# Altium project H750-BSC-DK.PrjPcb
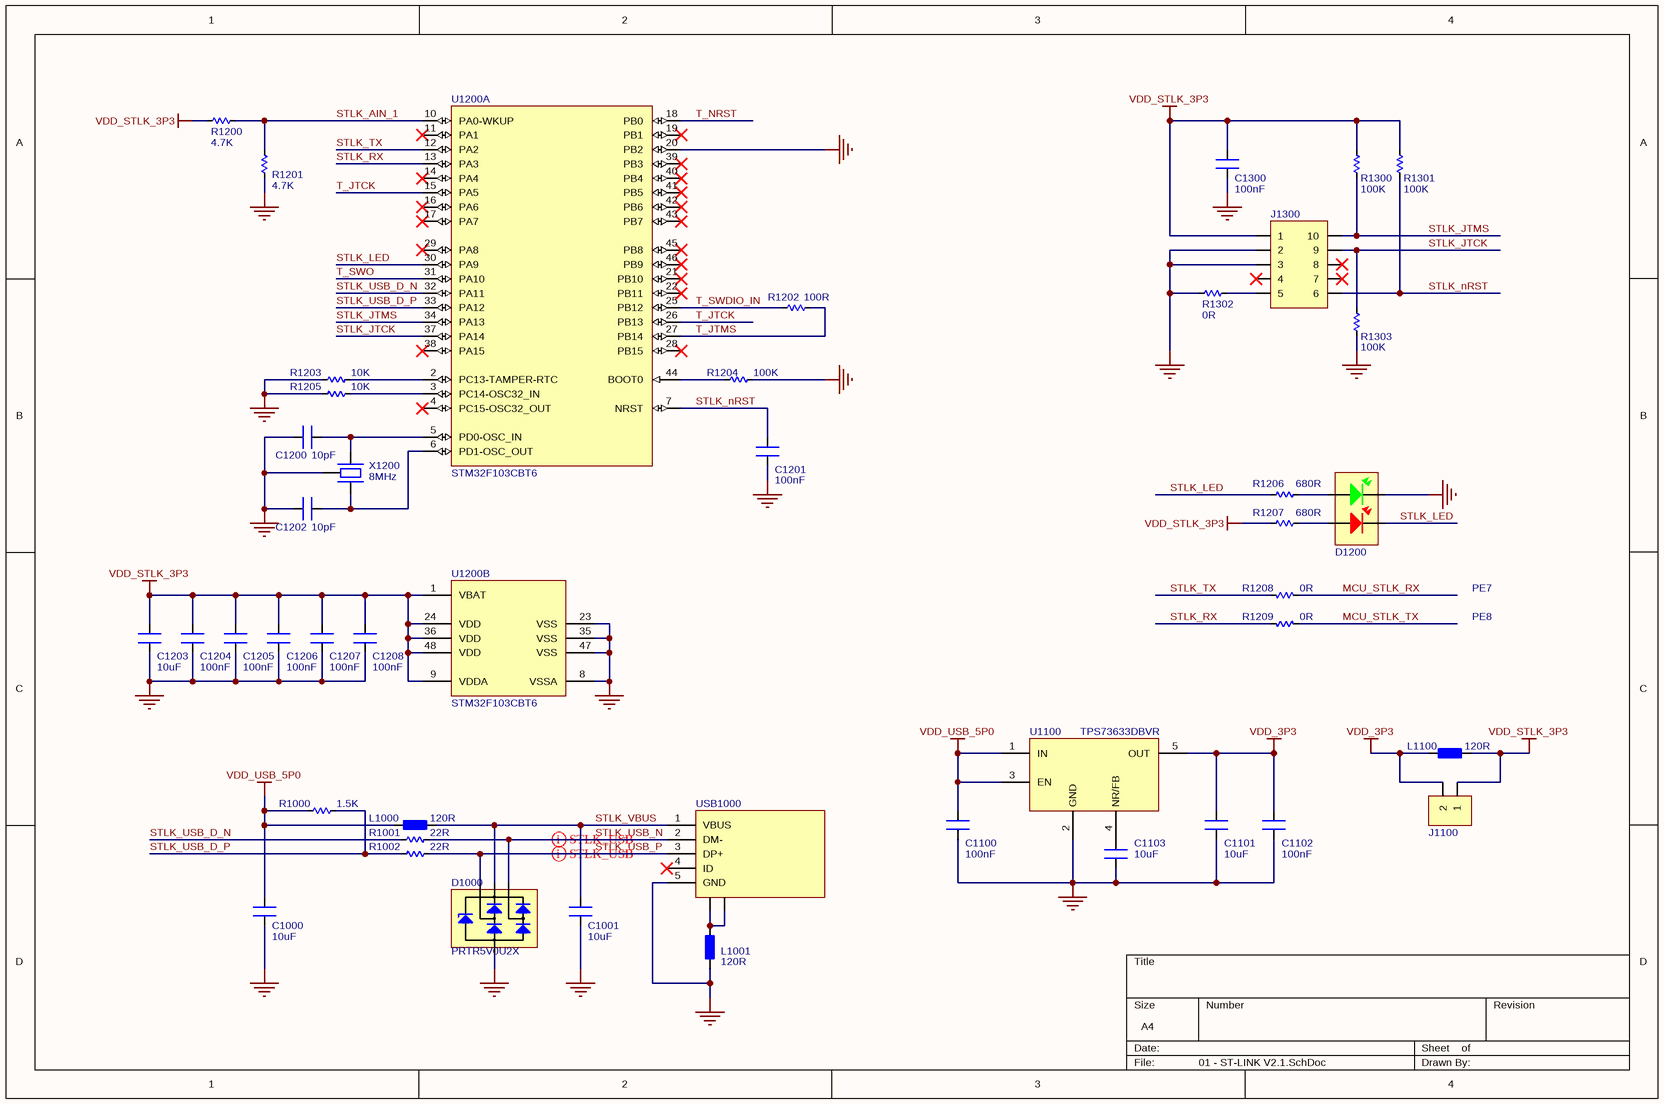
[diagram p0: 01 - ST-LINK V2.1.SchDoc]
7 sheets, 245 parts. Net scope: global (net labels, ports and power ports of the same name join across sheets).
Board file: H750-BSC-DK.PcbDoc
Sheets:
  00 - BLOCK DIAGRAM.SchDoc
  01 - ST-LINK V2.1.SchDoc
  02 - MCU.SchDoc
  03 - ETHERNET.SchDoc
  04 - AUDIO.SchDoc
  05 - QSPI & SD-CARD.SchDoc
  06 - USB.SchDoc

## Sheet 00 - BLOCK DIAGRAM.SchDoc
size A

## Sheet 01 - ST-LINK V2.1.SchDoc
size A4

### Parts
C1000  value 10uF  [CN-SMD-0603]  (hidden comment: Capacitor)
C1001  value 10uF  [CN-SMD-0603]  (hidden comment: Capacitor)
C1100  value 100nF  [CN-SMD-0603]  (hidden comment: Capacitor)
C1101  value 10uF  [CN-SMD-0603]  (hidden comment: Capacitor)
C1102  value 100nF  [CN-SMD-0603]  (hidden comment: Capacitor)
C1103  value 10uF  [CN-SMD-0603]  (hidden comment: Capacitor)
C1200  value 10pF  [CN-SMD-0402]  (hidden comment: Capacitor)
C1201  value 100nF  [CN-SMD-0402]  (hidden comment: Capacitor)
C1202  value 10pF  [CN-SMD-0402]  (hidden comment: Capacitor)
C1203  value 10uF  [CN-SMD-0603]  (hidden comment: Capacitor)
C1204  value 100nF  [CN-SMD-0402]  (hidden comment: Capacitor)
C1205  value 100nF  [CN-SMD-0402]  (hidden comment: Capacitor)
C1206  value 100nF  [CN-SMD-0402]  (hidden comment: Capacitor)
C1207  value 100nF  [CN-SMD-0402]  (hidden comment: Capacitor)
C1208  value 100nF  [CN-SMD-0402]  (hidden comment: Capacitor)
C1300  value 100nF  [CN-SMD-0402]  (hidden comment: Capacitor)
D1000  PRTR5V0U2X  [SOT-143]
D1200  LED  [LED-SMD-1615M-RG]  (value not drawn)
J1100  JP2  [JP2-D1T]  (value not drawn)
J1300  Terminal strip  [JP1.27-10P]  (value not drawn)
L1000  value 120R  [L-SMD-0603]  (hidden comment: Ferrite bead)
L1001  value 120R  [L-SMD-0603]  (hidden comment: Ferrite bead)
L1100  value 120R  [L-SMD-0402]  (hidden comment: Ferrite bead)
R1000  value 1.5K  [RES-SMD-0402]  (hidden comment: Resistor)
R1001  value 22R  [RES-SMD-0402]  (hidden comment: Resistor)
R1002  value 22R  [RES-SMD-0402]  (hidden comment: Resistor)
R1200  value 4.7K  [RES-SMD-0402]  (hidden comment: Resistor)
R1201  value 4.7K  [RES-SMD-0402]  (hidden comment: Resistor)
R1202  value 100R  [RES-SMD-0402]  (hidden comment: Resistor)
R1203  value 10K  [RES-SMD-0402]  (hidden comment: Resistor)
R1204  value 100K  [RES-SMD-0402]  (hidden comment: Resistor)
R1205  value 10K  [RES-SMD-0402]  (hidden comment: Resistor)
R1206  value 680R  [RES-SMD-0402]  (hidden comment: Resistor)
R1207  value 680R  [RES-SMD-0402]  (hidden comment: Resistor)
R1208  value 0R  [RES-SMD-0402]  (hidden comment: Resistor)
R1209  value 0R  [RES-SMD-0402]  (hidden comment: Resistor)
R1300  value 100K  [RES-SMD-0402]  (hidden comment: Resistor)
R1301  value 100K  [RES-SMD-0402]  (hidden comment: Resistor)
R1302  value 0R  [RES-SMD-0402]  (hidden comment: Resistor)
R1303  value 100K  [RES-SMD-0402]  (hidden comment: Resistor)
U1100  TPS73633DBVR  [SOT-23-5]
U1200  STM32F103CBT6  [LQFP50P900X900X160-48N]  (parts A,B of 2)
USB1000  USB  [USB_micro-B_F_SMD-2]  (value not drawn)
X1200  Frequency: 8MHz  [XT-SMD-3213M-3P]  (hidden comment: Crystal)

### Nets
GND: C1000.1 C1001.1 C1100.1 C1101.1 C1102.1 C1103.1 C1200.2 C1201.1 C1202.2 C1203.1 C1204.1 C1205.1 C1206.1 C1207.1 C1208.1 C1300.1 D1000.1(GND) D1200.2(GREEN_CN) J1300.2 J1300.3 L1001.1 R1201.2 R1203.2 R1204.1 R1205.2 R1302.2 R1303.2 U1100.2(GND) U1200.8(VSSA) U1200.20(PB2) U1200.23(VSS) U1200.35(VSS) U1200.47(VSS) USB1000.5(GND) X1200.3
VDD_3P3: C1101.2 C1102.2 J1100.2 L1100.2 U1100.5(OUT)
VDD_STLK_3P3: C1203.2 C1204.2 C1205.2 C1206.2 C1207.2 C1208.2 C1300.2 J1100.1 J1300.1 L1100.1 R1200.2 R1207.2 R1300.1 R1301.1 U1200.1(VBAT) U1200.9(VDDA) U1200.24(VDD) U1200.36(VDD) U1200.48(VDD)
VDD_USB_5P0: C1000.2 C1100.2 L1000.2 R1000.2 U1100.1(IN) U1100.3(EN)
MCU_STLK_RX: R1208.1
MCU_STLK_TX: R1209.1
STLK_AIN_1: R1200.1 R1201.1 U1200.10(PA0-WKUP)
STLK_JTCK: J1300.9 R1303.1 U1200.37(PA14)
STLK_JTMS: J1300.10 R1300.2 U1200.34(PA13)
STLK_LED: D1200.1(RED_CN) R1206.2 U1200.30(PA9)
STLK_nRST: C1201.2 J1300.6 R1301.2 U1200.7(NRST)
STLK_RX: R1209.2 U1200.13(PA3)
STLK_TX: R1208.2 U1200.12(PA2)
STLK_USB_D_N: R1001.2 U1200.32(PA11)
STLK_USB_D_P: R1000.1 R1002.2 U1200.33(PA12)
STLK_USB_N: D1000.3 R1001.1 USB1000.2(DM-)
STLK_USB_P: D1000.2 R1002.1 USB1000.3(DP+)
STLK_VBUS: C1001.2 D1000.4(VDD) L1000.1 USB1000.1(VBUS)
T_JTCK: U1200.15(PA5) U1200.26(PB13)
T_JTMS: R1202.1 U1200.27(PB14)
T_NRST: U1200.18(PB0)
T_SWDIO_IN: R1202.2 U1200.25(PB12)
T_SWO: U1200.31(PA10)
NetC1103_2: C1103.2 U1100.4(NR/FB)
NetC1200_1: C1200.1 U1200.5(PD0-OSC_IN) X1200.1
NetC1202_1: C1202.1 U1200.6(PD1-OSC_OUT) X1200.2
NetD1200_3: D1200.3(GREEN_AN) R1206.1
NetD1200_4: D1200.4(RED_AN) R1207.1
NetJ1300_5: J1300.5 R1302.1
NetL1001_2: L1001.2 USB1000.0
NetR1203_1: R1203.1 U1200.2(PC13-TAMPER-RTC)
NetR1204_2: R1204.2 U1200.44(BOOT0)
NetR1205_1: R1205.1 U1200.3(PC14-OSC32_IN)

Not connected (* = marked no-connect by the designer): J1300 4* 7* 8*; U1200 4(PC15-OSC32_OUT)* 11(PA1)* 14(PA4)* 16(PA6)* 17(PA7)* 19(PB1)* 21(PB10)* 22(PB11)* 28(PB15)* 29(PA8)* 38(PA15)* 39(PB3)* 40(PB4)* 41(PB5)* 42(PB6)* 43(PB7)* 45(PB8)* 46(PB9)*; USB1000 4(ID)*

### Layout directives
differential pair; differential pair class STLK_USB: STLK_USB_N, STLK_USB_P

### Notes on the sheet
- PE7
- PE8

### Library data of the parts
C1000 C1001 C1101 C1103 C1203 = Cap: Ceramic Capacitor SMD 0603 10uF ±20% 10V
C1100 C1102 = Cap: Ceramic Capacitor SMD 0603 100nF ±20% 50V
C1200 C1202 = Cap: Ceramic Capacitor SMD 0402 10pF ±20% 50V
C1201 C1204-C1208 C1300 = Cap: Ceramic Capacitor SMD 0402 100nF ±20% 16V
D1000 = PRTR5V0U2X: Ultra low capacitance double rail-to-rail ESD protection diode
D1200 = LED RG: LED bicolor red green SMD-1615
J1100 = JP2: Single 2-pin jumper
J1300 = JP5x2: Terminal strip 5-pin 2-row pitch 0.05" (1.27mm) SMD straight
L1000 L1001 = Ferrite bead: Ferrite bead SMD 0603 120 Ohm @100MHz
L1100 = Ferrite bead: Ferrite bead SMD 0402 120 Ohm @100MHz
R1000 = Res: Resistor SMD 0402 1.5K 1% 0.063W
R1001 R1002 = Res: Resistor SMD 0402 22R 1% 0.063W
R1200 R1201 = Res: Resistor SMD 0402 4.7K 1% 0.063W
R1202 = Res: Resistor SMD 0402 100R 1% 0.063W
R1203 R1205 = Res: Resistor SMD 0402 10K 1% 0.063W
R1204 R1300 R1301 R1303 = Res: Resistor SMD 0402 100K 1% 0.063W
R1206 R1207 = Res: Resistor SMD 0402 680R 1% 0.063W
R1208 R1209 R1302 = Res: Resistor SMD 0402 0R 1% 0.063W
U1100 = TPS73633DBVR: Cap-Free, NMOS, 400-mA Low-Dropout Regulator with Reverse Current Protection
U1200 = STM32F103CBT6: ARM Cortex-M3 32-bit MCU, 128 KB Flash, 20 KB Internal RAM, 37 I/Os, 48-pin LQFP, -40 to 85 degC, Tray; A/D Converter: 2x12-bit (10 Channel); FLASH Size (Prog) (kB): 128; I/Os (High Current): 37; Internal RAM Size (kB): 20; Operating Frequency(F) (Processor speed) (MHz): 72; Supply Voltage(Vcc) min (V): 2; DatasheetVersion: Rev. 16; PackageVersion: Rev. 6, 06/2013; PackageReference: LQFP48; PackageDescription: 48-Pin Low Profile Quad Flat Package, 7 x 7 mm Body, 0.5 mm Pitch; Supplier 1: Digi-Key; Supplier Part Number 1: 497-6288-ND; Supplier 2: Farnell; Supplier Part Number 2: 1606327; Supplier 3: Newark; Supplier Part Number 3: 11N8296; Supplier 4: Newark; Supplier Part Number 4: 57P1214; Supplier 5: Mouser; Supplier Part Number 5: 511-STM32F103CBT6; Core: ARM Cortex-M3; Packing: Tray; Mounting Technology: Surface Mount; PartNumber: STM32F103CBT6; ComponentLink1Description: Manufacturer URL; ComponentLink1URL: http://www.st.com/web/en/home.html; ComponentLink2Description: Datasheet; ComponentLink2URL: http://www.st.com/st-web-ui/static/active/en/resource/technical/document/datasheet/CD00161566.pdf; ComponentLink3Description: Package Specification; ComponentLink3URL: http://www.st.com/st-web-ui/static/active/en/resource/technical/document/datasheet/DM00058181.pdf
USB1000 = USB-5: USB female SMD micro-B type
X1200 = XT3: Crystal Oscillator SMD-3123 8MHz 3-pin

## Sheet 02 - MCU.SchDoc
size A3
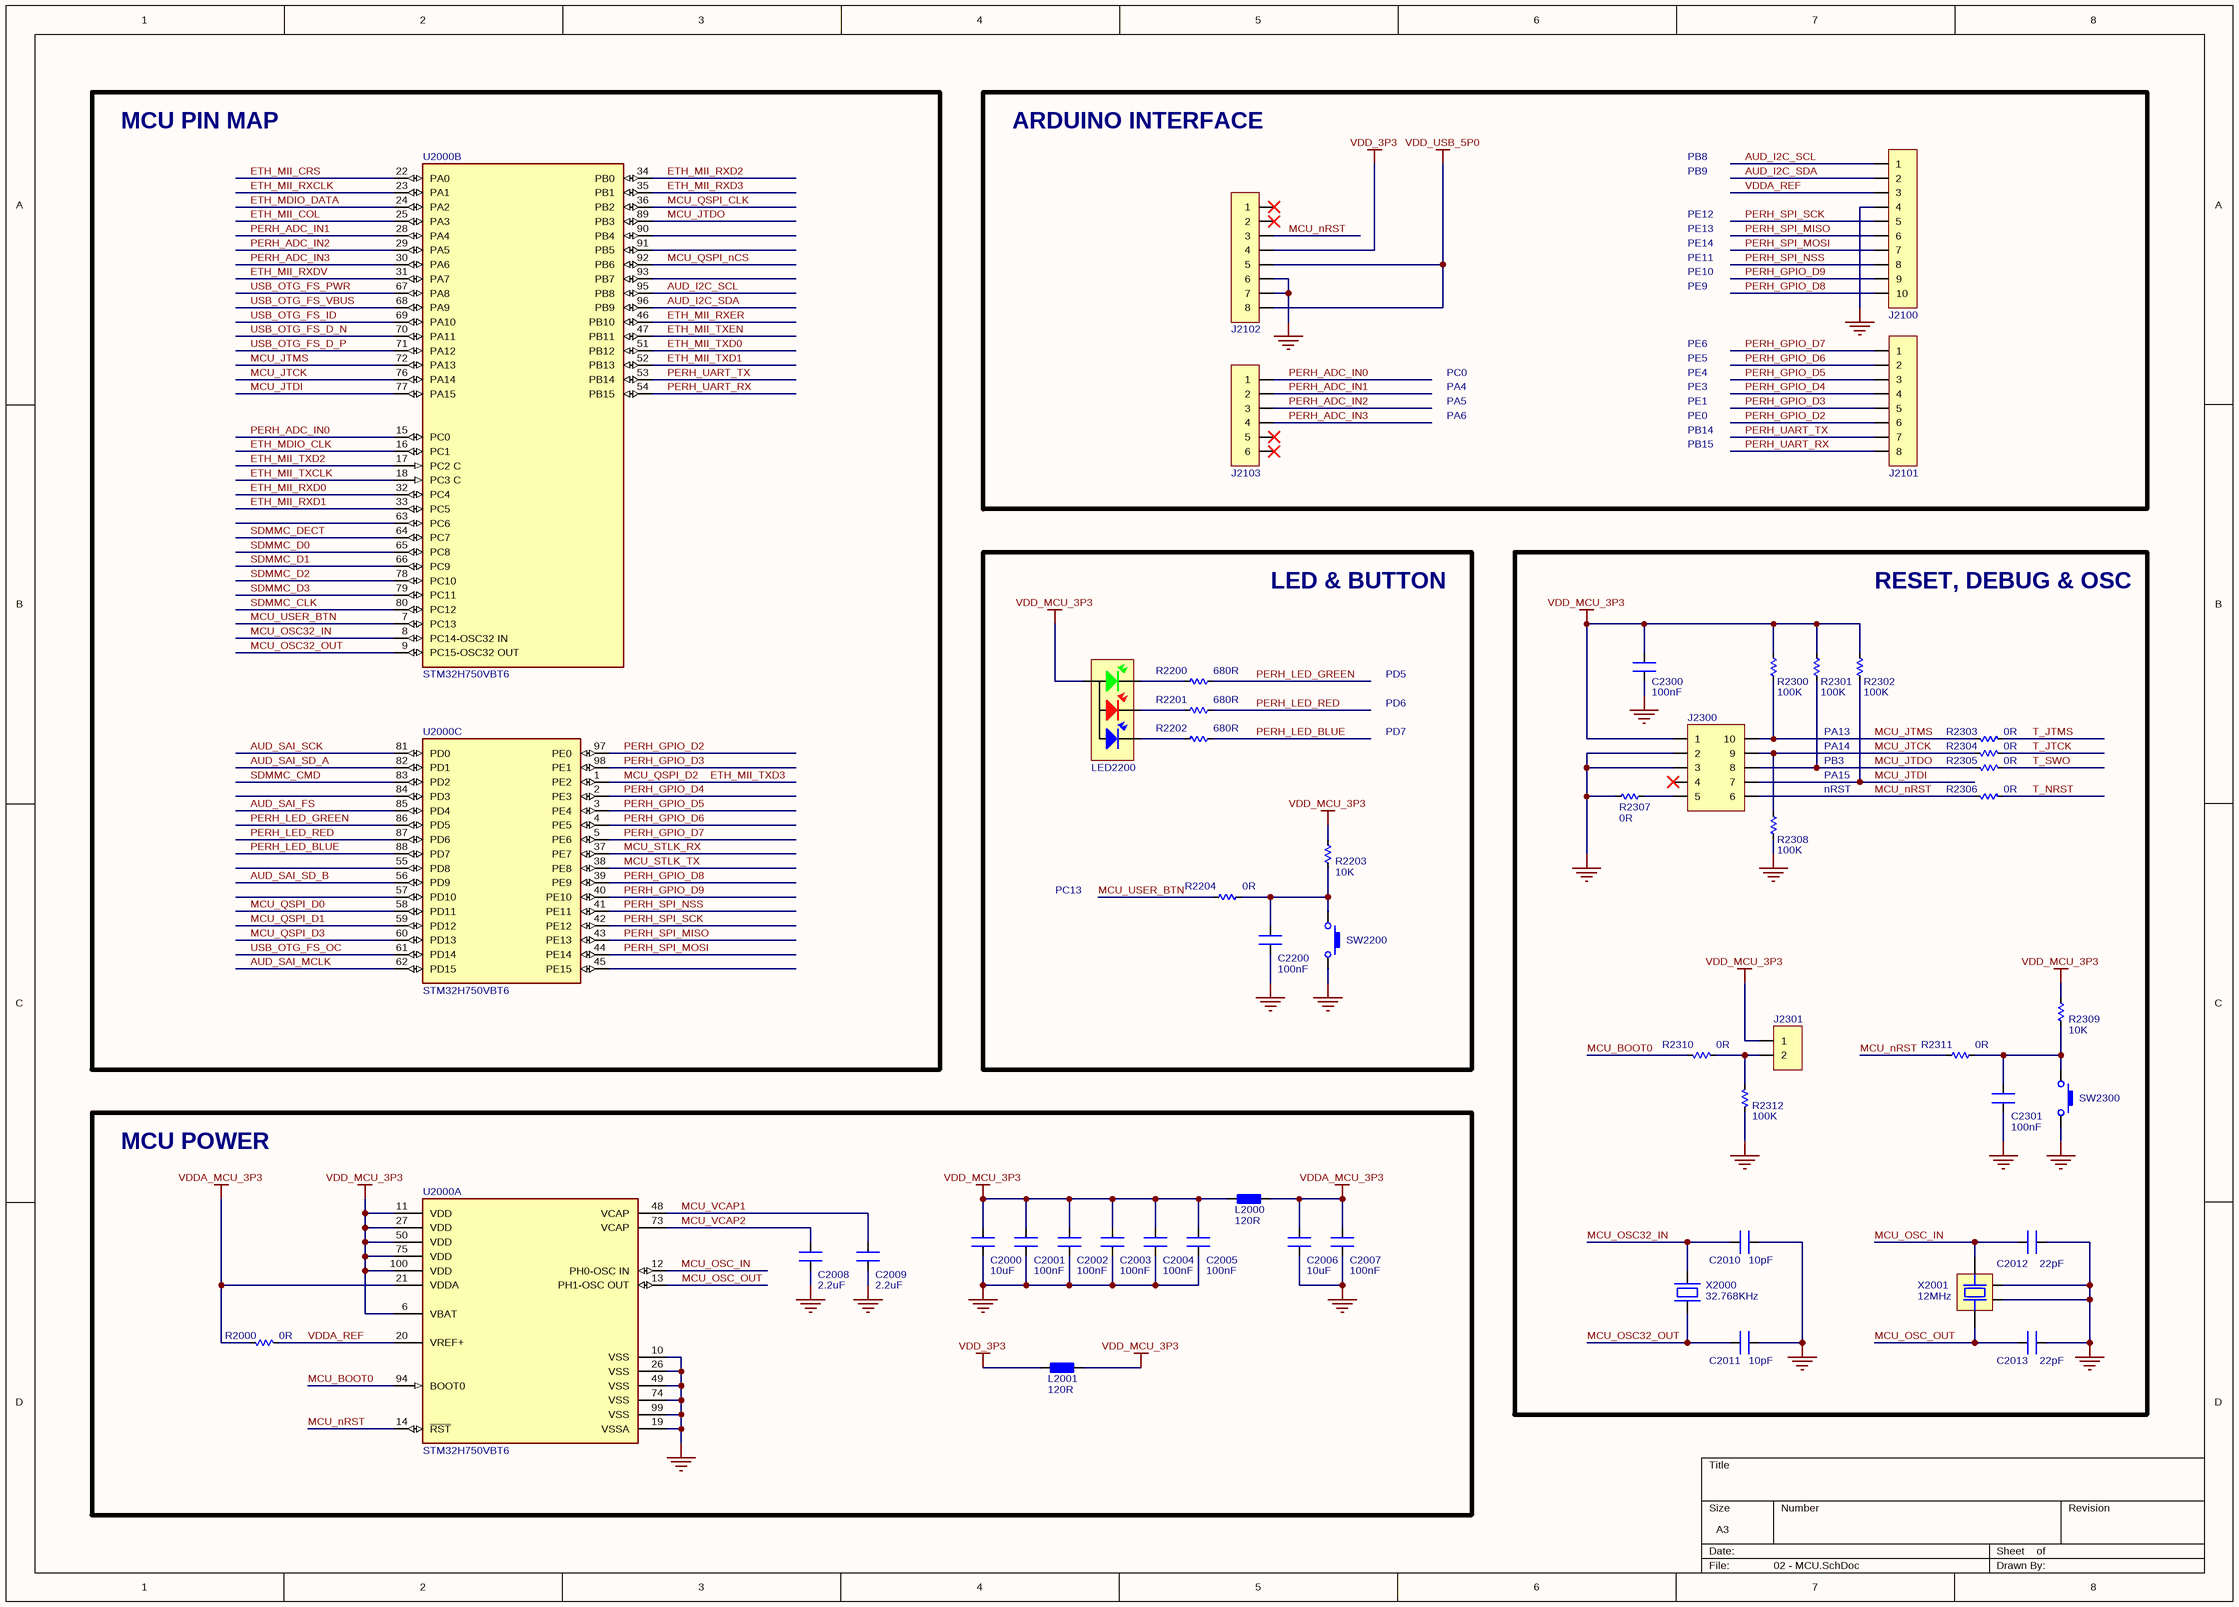
[diagram p1: 02 - MCU.SchDoc]

### Parts
C2000  value 10uF  [CN-SMD-0603]  (hidden comment: Capacitor)
C2001  value 100nF  [CN-SMD-0402]  (hidden comment: Capacitor)
C2002  value 100nF  [CN-SMD-0402]  (hidden comment: Capacitor)
C2003  value 100nF  [CN-SMD-0402]  (hidden comment: Capacitor)
C2004  value 100nF  [CN-SMD-0402]  (hidden comment: Capacitor)
C2005  value 100nF  [CN-SMD-0402]  (hidden comment: Capacitor)
C2006  value 10uF  [CN-SMD-0603]  (hidden comment: Capacitor)
C2007  value 100nF  [CN-SMD-0402]  (hidden comment: Capacitor)
C2008  value 2.2uF  [CN-SMD-0603]  (hidden comment: Capacitor)
C2009  value 2.2uF  [CN-SMD-0603]  (hidden comment: Capacitor)
C2010  value 10pF  [CN-SMD-0402]  (hidden comment: Capacitor)
C2011  value 10pF  [CN-SMD-0402]  (hidden comment: Capacitor)
C2012  value 22pF  [CN-SMD-0402]  (hidden comment: Capacitor)
C2013  value 22pF  [CN-SMD-0402]  (hidden comment: Capacitor)
C2200  value 100nF  [CN-SMD-0402]  (hidden comment: Capacitor)
C2300  value 100nF  [CN-SMD-0402]  (hidden comment: Capacitor)
C2301  value 100nF  [CN-SMD-0402]  (hidden comment: Capacitor)
J2100  Terminal strip  [JP10-C1T]  (value not drawn)
J2101  Terminal strip  [JP8-C1T]  (value not drawn)
J2102  Terminal strip  [JP8-C1T]  (value not drawn)
J2103  Terminal strip  [JP6-C1T]  (value not drawn)
J2300  Terminal strip  [JP1.27-10P]  (value not drawn)
J2301  JP2  [JP2-D1T]  (value not drawn)
L2000  value 120R  [L-SMD-0402]  (hidden comment: Ferrite bead)
L2001  value 120R  [L-SMD-0603]  (hidden comment: Ferrite bead)
LED2200  LED  [LED-SMD-3528-RGB]  (value not drawn)
R2000  value 0R  [RES-SMD-0402]  (hidden comment: Resistor)
R2200  value 680R  [RES-SMD-0402]  (hidden comment: Resistor)
R2201  value 680R  [RES-SMD-0402]  (hidden comment: Resistor)
R2202  value 680R  [RES-SMD-0402]  (hidden comment: Resistor)
R2203  value 10K  [RES-SMD-0402]  (hidden comment: Resistor)
R2204  value 0R  [RES-SMD-0402]  (hidden comment: Resistor)
R2300  value 100K  [RES-SMD-0402]  (hidden comment: Resistor)
R2301  value 100K  [RES-SMD-0402]  (hidden comment: Resistor)
R2302  value 100K  [RES-SMD-0402]  (hidden comment: Resistor)
R2303  value 0R  [RES-SMD-0402]  (hidden comment: Resistor)
R2304  value 0R  [RES-SMD-0402]  (hidden comment: Resistor)
R2305  value 0R  [RES-SMD-0402]  (hidden comment: Resistor)
R2306  value 0R  [RES-SMD-0402]  (hidden comment: Resistor)
R2307  value 0R  [RES-SMD-0402]  (hidden comment: Resistor)
R2308  value 100K  [RES-SMD-0402]  (hidden comment: Resistor)
R2309  value 10K  [RES-SMD-0402]  (hidden comment: Resistor)
R2310  value 0R  [RES-SMD-0402]  (hidden comment: Resistor)
R2311  value 0R  [RES-SMD-0402]  (hidden comment: Resistor)
R2312  value 100K  [RES-SMD-0402]  (hidden comment: Resistor)
SW2200  Switch  [SW2-SMD-3x4x2M]  (value not drawn)
SW2300  Switch  [SW2-SMD-3x4x2M]  (value not drawn)
U2000  STM32H750VBT6  [FP-LQFP100-1L-IPC_A]  (parts A,B,C of 3)
X2000  value 32.768KHz  [XT-SMD-FC-135]  (hidden comment: Crystal)
X2001  value 12MHz  [XT-SMD-3225-4P]  (hidden comment: Crystal)

### Blocks framed on the sheet
MCU PIN MAP: U2000
ARDUINO INTERFACE: J2100-J2103
LED & BUTTON: C2200 LED2200 R2200-R2204 SW2200
RESET, DEBUG & OSC: C2010-C2013 C2300 C2301 J2300 J2301 R2300-R2312 SW2300 X2000 X2001
MCU POWER: C2000-C2009 L2000 L2001 R2000 U2000

### Nets
GND: C2000.1 C2001.1 C2002.1 C2003.1 C2004.1 C2005.1 C2006.1 C2007.1 C2008.1 C2009.1 C2010.1 C2011.1 C2012.2 C2013.2 C2200.1 C2300.1 C2301.1 J2100.4 J2102.6 J2102.7 J2300.2 J2300.3 R2307.2 R2308.2 R2312.2 SW2200.2 SW2300.2 U2000.10(VSS) U2000.19(VSSA) U2000.26(VSS) U2000.49(VSS) U2000.74(VSS) U2000.99(VSS) X2001.2 X2001.4
VDD_3P3: J2102.4 L2001.2
VDD_MCU_3P3: C2000.2 C2001.2 C2002.2 C2003.2 C2004.2 C2005.2 C2300.2 J2300.1 J2301.1 L2000.2 L2001.1 LED2200.2(Common) R2203.1 R2300.1 R2301.1 R2302.1 R2309.1 U2000.6(VBAT) U2000.11(VDD) U2000.27(VDD) U2000.50(VDD) U2000.75(VDD) U2000.100(VDD)
VDD_USB_5P0: J2102.5 J2102.8
VDDA_MCU_3P3: C2006.2 C2007.2 L2000.1 R2000.2 U2000.21(VDDA)
AUD_I2C_SCL: J2100.1 U2000.95(PB8)
AUD_I2C_SDA: J2100.2 U2000.96(PB9)
AUD_SAI_FS: U2000.85(PD4)
AUD_SAI_MCLK: U2000.62(PD15)
AUD_SAI_SCK: U2000.81(PD0)
AUD_SAI_SD_A: U2000.82(PD1)
AUD_SAI_SD_B: U2000.56(PD9)
ETH_MDIO_CLK: U2000.16(PC1)
ETH_MDIO_DATA: U2000.24(PA2)
ETH_MII_COL: U2000.25(PA3)
ETH_MII_CRS: U2000.22(PA0)
ETH_MII_RXCLK: U2000.23(PA1)
ETH_MII_RXD0: U2000.32(PC4)
ETH_MII_RXD1: U2000.33(PC5)
ETH_MII_RXD2: U2000.34(PB0)
ETH_MII_RXD3: U2000.35(PB1)
ETH_MII_RXDV: U2000.31(PA7)
ETH_MII_RXER: U2000.46(PB10)
ETH_MII_TXCLK: U2000.18(PC3_C)
ETH_MII_TXD0: U2000.51(PB12)
ETH_MII_TXD1: U2000.52(PB13)
ETH_MII_TXD2: U2000.17(PC2_C)
ETH_MII_TXD3: U2000.1(PE2)  [also labelled MCU_QSPI_D2]
ETH_MII_TXEN: U2000.47(PB11)
MCU_BOOT0: R2310.2 U2000.94(BOOT0)
MCU_JTCK: J2300.9 R2304.2 R2308.1 U2000.76(PA14)
MCU_JTDI: J2300.7 R2302.2 U2000.77(PA15)
MCU_JTDO: J2300.8 R2301.2 R2305.2 U2000.89(PB3)
MCU_JTMS: J2300.10 R2300.2 R2303.2 U2000.72(PA13)
MCU_nRST: J2102.3 J2300.6 R2306.2 R2311.1 U2000.14(~{RST})
MCU_OSC32_IN: C2010.2 U2000.8(PC14-OSC32_IN) X2000.2
MCU_OSC32_OUT: C2011.2 U2000.9(PC15-OSC32_OUT) X2000.1
MCU_OSC_IN: C2012.1 U2000.12(PH0-OSC_IN) X2001.3
MCU_OSC_OUT: C2013.1 U2000.13(PH1-OSC_OUT) X2001.1
MCU_QSPI_CLK: U2000.36(PB2)
MCU_QSPI_D0: U2000.58(PD11)
MCU_QSPI_D1: U2000.59(PD12)
MCU_QSPI_D3: U2000.60(PD13)
MCU_QSPI_nCS: U2000.92(PB6)
MCU_STLK_RX: U2000.37(PE7)
MCU_STLK_TX: U2000.38(PE8)
MCU_USER_BTN: R2204.1 U2000.7(PC13)
MCU_VCAP1: C2009.2 U2000.48(VCAP)
MCU_VCAP2: C2008.2 U2000.73(VCAP)
PERH_ADC_IN0: J2103.1 U2000.15(PC0)
PERH_ADC_IN1: J2103.2 U2000.28(PA4)
PERH_ADC_IN2: J2103.3 U2000.29(PA5)
PERH_ADC_IN3: J2103.4 U2000.30(PA6)
PERH_GPIO_D2: J2101.6 U2000.97(PE0)
PERH_GPIO_D3: J2101.5 U2000.98(PE1)
PERH_GPIO_D4: J2101.4 U2000.2(PE3)
PERH_GPIO_D5: J2101.3 U2000.3(PE4)
PERH_GPIO_D6: J2101.2 U2000.4(PE5)
PERH_GPIO_D7: J2101.1 U2000.5(PE6)
PERH_GPIO_D8: J2100.10 U2000.39(PE9)
PERH_GPIO_D9: J2100.9 U2000.40(PE10)
PERH_LED_BLUE: R2202.2 U2000.88(PD7)
PERH_LED_GREEN: R2200.2 U2000.86(PD5)
PERH_LED_RED: R2201.2 U2000.87(PD6)
PERH_SPI_MISO: J2100.6 U2000.43(PE13)
PERH_SPI_MOSI: J2100.7 U2000.44(PE14)
PERH_SPI_NSS: J2100.8 U2000.41(PE11)
PERH_SPI_SCK: J2100.5 U2000.42(PE12)
PERH_UART_RX: J2101.8 U2000.54(PB15)
PERH_UART_TX: J2101.7 U2000.53(PB14)
SDMMC_CLK: U2000.80(PC12)
SDMMC_CMD: U2000.83(PD2)
SDMMC_D0: U2000.65(PC8)
SDMMC_D1: U2000.66(PC9)
SDMMC_D2: U2000.78(PC10)
SDMMC_D3: U2000.79(PC11)
SDMMC_DECT: U2000.64(PC7)
T_JTCK: R2304.1
T_JTMS: R2303.1
T_NRST: R2306.1
T_SWO: R2305.1
USB_OTG_FS_D_N: U2000.70(PA11)
USB_OTG_FS_D_P: U2000.71(PA12)
USB_OTG_FS_ID: U2000.69(PA10)
USB_OTG_FS_OC: U2000.61(PD14)
USB_OTG_FS_PWR: U2000.67(PA8)
USB_OTG_FS_VBUS: U2000.68(PA9)
VDDA_REF: J2100.3 R2000.1 U2000.20(VREF+)
NetC2200_2: C2200.2 R2203.2 R2204.2 SW2200.1
NetC2301_2: C2301.2 R2309.2 R2311.2 SW2300.1
NetJ2300_5: J2300.5 R2307.1
NetJ2301_2: J2301.2 R2310.1 R2312.1
NetLED2200_1: LED2200.1(Red_Cathode) R2201.1
NetLED2200_3: LED2200.3(Blue_Cathode) R2202.1
NetLED2200_4: LED2200.4(Green_Cathode) R2200.1

Not connected (* = marked no-connect by the designer): J2102 1* 2*; J2103 5* 6*; J2300 4*; U2000 45(PE15) 55(PD8) 57(PD10) 63(PC6) 84(PD3) 90(PB4) 91(PB5) 93(PB7)

### Notes on the sheet
- PB8
- PB9
- PE12
- PE13
- PE14
- PE11
- PE9
- PE10
- PC0
- PA4
- PA5
- PE1
- PE3
- PE4
- PE5
- PE6
- PA6
- PB14
- PB15
- PE0
- PD5
- PD6
- PD7
- PA13
- PA14
- PB3
- PA15
- nRST
- PC13

### Library data of the parts
C2000 C2006 = Cap: Ceramic Capacitor SMD 0603 10uF ±20% 10V
C2001-C2005 C2007 C2200 C2300 C2301 = Cap: as C1201 on sheet 01 - ST-LINK V2.1
C2008 C2009 = Cap: Ceramic Capacitor SMD 0603 2.2uF ±20% 16V
C2010 C2011 = Cap: Ceramic Capacitor SMD 0402 10pF ±20% 50V
C2012 C2013 = Cap: Ceramic Capacitor SMD 0402 22pF ±20% 50V
J2100 = JP10: Terminal strip 10-pin 1-row pitch 0.1" (2.54mm) DIP straight
J2101 J2102 = JP8: Terminal strip 8-pin 1-row pitch 0.1" (2.54mm) DIP straight
J2103 = JP6: Terminal strip 6-pin 1-row pitch 0.1" (2.54mm) DIP straight
J2300 = JP5x2: as J1300 on sheet 01 - ST-LINK V2.1
J2301 = JP2: Single 2-pin jumper
L2000 = Ferrite bead: Ferrite bead SMD 0402 120 Ohm @100MHz
L2001 = Ferrite bead: Ferrite bead SMD 0603 120 Ohm @100MHz
LED2200 = LED RGB CA: LED RGB Common Anode SMD-3528
R2000 R2204 R2303-R2307 R2310 R2311 = Res: Resistor SMD 0402 0R 1% 0.063W
R2200-R2202 = Res: Resistor SMD 0402 680R 1% 0.063W
R2203 R2309 = Res: Resistor SMD 0402 10K 1% 0.063W
R2300-R2302 R2308 R2312 = Res: Resistor SMD 0402 100K 1% 0.063W
SW2200 SW2300 = SW2: Tackle Switch 2-pin SMD 3x4x2mm
U2000 = CMP-12105-000017-1: 32-bit Arm® Cortex®-M7 480MHz MCUs, 128 Kbyte Flash, 1 Mbyte RAM, 46 com. and analog interfaces, crypto; Manufacturer: STMicroelectronics; Number Of Uart Channels: 9; Number Of I/Os: 82; Max Junction Temp: +125°C; Data Bus Width: 32bits; Ram Size: 1MBytes; Min Supply Voltage: 1.62V; Number Of Spi Channels: 6; Number Of Adc Channels: 36; Max Supply Voltage: 3.6V; Standoff Height: 0.05mm; Interface: I2C,SPI,UART,USART,CAN,USB,LIN,IrDA,Ethernet,I2S,Other; Number Of A/D Converters: 3; Number Of I2C Channels: 4; Memory Size: 128KBytes; Number Of Timers/Counters: 20; Number Of Ethernet Channels: 1; Core Architecture: ARM Cortex-M7; Number Of Usb Channels: 2; Number Of Pwm Channels: 42; Ambient Temperature Range High: +85°C; Temperature: -40°C to +125°C; ComponentLink2URL: https://www.st.com/resource/en/datasheet/stm32h750vb.pdf; Device Class L2: Embedded Processors and Controllers; Temperature Range Low: -40°C; Octopart: https://octopart.com/stm32h750vbt6-stmicroelectronics-94048547; Category: IC; Manufacturer Part Number: STM32H750VBT6; Height: 1.6mm; Lead Free: Yes; Device Class L1: Integrated Circuits (ICs); Digikey Description: IC MCU 32BIT 128KB FLASH 100LQFP; RoHS: TRUE; Ambient Temperature Range Low: -40°C; Device Class L3: Microcontrollers; ComponentLink2Description: Datasheet; Frequency: 480MHz; Mouser Description: MCU 32-Bit STM32H750VB ARM Cortex M7 RISC 128KB Flash 1.8V/2.5V/3.3V 100-Pin LQFP Tray; Number Of Cores: 1; Automotive: No; Memory Type: FLASH; Package: LQFP100-1L; Temperature Range High: +125°C
X2000 = XT2: Crystal Oscillator FC-135 32.768KHz 2-pin
X2001 = XT4: Crystal Oscillator SMD-3225 12MHz 4-pin

## Sheet 03 - ETHERNET.SchDoc
size A4
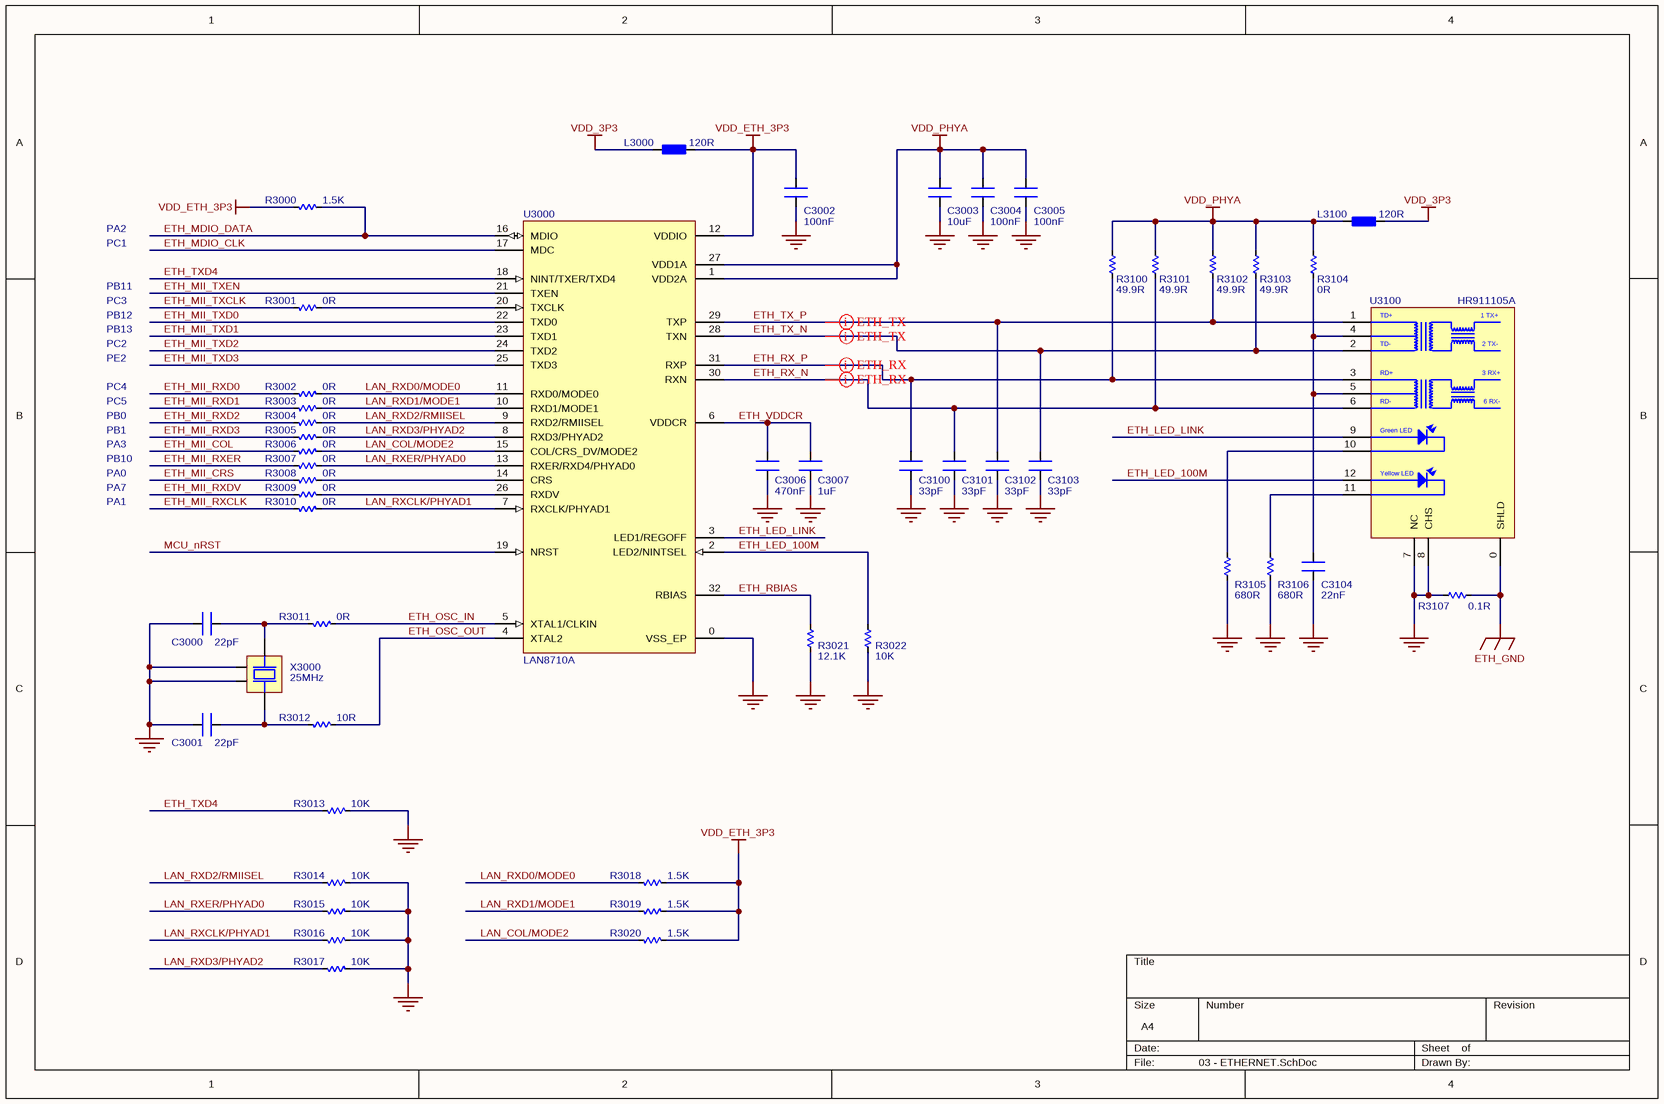
[diagram p2: 03 - ETHERNET.SchDoc]

### Parts
C3000  value 22pF  [CN-SMD-0402]  (hidden comment: Capacitor)
C3001  value 22pF  [CN-SMD-0402]  (hidden comment: Capacitor)
C3002  value 100nF  [CN-SMD-0402]  (hidden comment: Capacitor)
C3003  value 10uF  [CN-SMD-0603]  (hidden comment: Capacitor)
C3004  value 100nF  [CN-SMD-0402]  (hidden comment: Capacitor)
C3005  value 100nF  [CN-SMD-0402]  (hidden comment: Capacitor)
C3006  value 470nF  [CN-SMD-0402]  (hidden comment: Capacitor)
C3007  value 1uF  [CN-SMD-0603]  (hidden comment: Capacitor)
C3100  value 33pF  [CN-SMD-0402]  (hidden comment: Capacitor)
C3101  value 33pF  [CN-SMD-0402]  (hidden comment: Capacitor)
C3102  value 33pF  [CN-SMD-0402]  (hidden comment: Capacitor)
C3103  value 33pF  [CN-SMD-0402]  (hidden comment: Capacitor)
C3104  value 22nF  [CN-SMD-0402]  (hidden comment: Capacitor)
L3000  value 120R  [L-SMD-0603]  (hidden comment: Ferrite bead)
L3100  value 120R  [L-SMD-0603]  (hidden comment: Ferrite bead)
R3000  value 1.5K  [RES-SMD-0402]  (hidden comment: Resistor)
R3001  value 0R  [RES-SMD-0402]  (hidden comment: Resistor)
R3002  value 0R  [RES-SMD-0402]  (hidden comment: Resistor)
R3003  value 0R  [RES-SMD-0402]  (hidden comment: Resistor)
R3004  value 0R  [RES-SMD-0402]  (hidden comment: Resistor)
R3005  value 0R  [RES-SMD-0402]  (hidden comment: Resistor)
R3006  value 0R  [RES-SMD-0402]  (hidden comment: Resistor)
R3007  value 0R  [RES-SMD-0402]  (hidden comment: Resistor)
R3008  value 0R  [RES-SMD-0402]  (hidden comment: Resistor)
R3009  value 0R  [RES-SMD-0402]  (hidden comment: Resistor)
R3010  value 0R  [RES-SMD-0402]  (hidden comment: Resistor)
R3011  value 0R  [RES-SMD-0402]  (hidden comment: Resistor)
R3012  value 10R  [RES-SMD-0402]  (hidden comment: Resistor)
R3013  value 10K  [RES-SMD-0402]  (hidden comment: Resistor)
R3014  value 10K  [RES-SMD-0402]  (hidden comment: Resistor)
R3015  value 10K  [RES-SMD-0402]  (hidden comment: Resistor)
R3016  value 10K  [RES-SMD-0402]  (hidden comment: Resistor)
R3017  value 10K  [RES-SMD-0402]  (hidden comment: Resistor)
R3018  value 1.5K  [RES-SMD-0402]  (hidden comment: Resistor)
R3019  value 1.5K  [RES-SMD-0402]  (hidden comment: Resistor)
R3020  value 1.5K  [RES-SMD-0402]  (hidden comment: Resistor)
R3021  value 12.1K  [RES-SMD-0402]  (hidden comment: Resistor)
R3022  value 10K  [RES-SMD-0402]  (hidden comment: Resistor)
R3100  value 49.9R  [RES-SMD-0402]  (hidden comment: Resistor)
R3101  value 49.9R  [RES-SMD-0402]  (hidden comment: Resistor)
R3102  value 49.9R  [RES-SMD-0402]  (hidden comment: Resistor)
R3103  value 49.9R  [RES-SMD-0402]  (hidden comment: Resistor)
R3104  value 0R  [RES-SMD-0402]  (hidden comment: Resistor)
R3105  value 680R  [RES-SMD-0402]  (hidden comment: Resistor)
R3106  value 680R  [RES-SMD-0402]  (hidden comment: Resistor)
R3107  value 0.1R  [RES-SMD-1206]  (hidden comment: Resistor)
U3000  LAN8710A  [QFN50P500X500X100-33N-D]
U3100  HR911105A  [RJ-45_HR911105A]
X3000  value 25MHz  [XT-SMD-3225-4P]  (hidden comment: Crystal)

### Nets
ETH_GND: R3107.2 U3100.0(SHLD)
GND: C3000.2 C3001.2 C3002.1 C3003.1 C3004.1 C3005.1 C3006.1 C3007.1 C3100.1 C3101.1 C3102.1 C3103.1 C3104.1 R3013.1 R3014.1 R3015.1 R3016.1 R3017.1 R3021.1 R3022.2 R3105.2 R3106.2 R3107.1 U3000.0(VSS_EP) U3100.7(NC) U3100.8(CHS) X3000.2 X3000.4
VDD_3P3: L3000.2 L3100.1
VDD_ETH_3P3: C3002.2 L3000.1 R3000.2 R3018.1 R3019.1 R3020.1 U3000.12(VDDIO)
VDD_PHYA: C3003.2 C3004.2 C3005.2 L3100.2 R3100.1 R3101.1 R3102.1 R3103.1 R3104.1 U3000.1(VDD2A) U3000.27(VDD1A)
ETH_LED_100M: R3022.1 U3000.2(LED2/NINTSEL) U3100.12(Yellow+)
ETH_LED_LINK: U3000.3(LED1/REGOFF) U3100.9(Green+)
ETH_MDIO_CLK: U3000.17(MDC)
ETH_MDIO_DATA: R3000.1 U3000.16(MDIO)
ETH_MII_COL: R3006.2
ETH_MII_CRS: R3008.2
ETH_MII_RXCLK: R3010.2
ETH_MII_RXD0: R3002.2
ETH_MII_RXD1: R3003.2
ETH_MII_RXD2: R3004.2
ETH_MII_RXD3: R3005.2
ETH_MII_RXDV: R3009.2
ETH_MII_RXER: R3007.2
ETH_MII_TXCLK: R3001.2
ETH_MII_TXD0: U3000.22(TXD0)
ETH_MII_TXD1: U3000.23(TXD1)
ETH_MII_TXD2: U3000.24(TXD2)
ETH_MII_TXD3: U3000.25(TXD3)
ETH_MII_TXEN: U3000.21(TXEN)
ETH_OSC_IN: R3011.1 U3000.5(XTAL1/CLKIN)
ETH_OSC_OUT: R3012.1 U3000.4(XTAL2)
ETH_RBIAS: R3021.2 U3000.32(RBIAS)
ETH_RX_N: C3101.2 R3101.2 U3000.30(RXN) U3100.6(RD-)
ETH_RX_P: C3100.2 R3100.2 U3000.31(RXP) U3100.3(RD+)
ETH_TX_N: C3103.2 R3103.2 U3000.28(TXN) U3100.2(TD-)
ETH_TX_P: C3102.2 R3102.2 U3000.29(TXP) U3100.1(TD+)
ETH_TXD4: R3013.2 U3000.18(NINT/TXER/TXD4)
ETH_VDDCR: C3006.2 C3007.2 U3000.6(VDDCR)
LAN_COL/MODE2: R3006.1 R3020.2 U3000.15(COL/CRS_DV/MODE2)
LAN_RXCLK/PHYAD1: R3010.1 R3016.2 U3000.7(RXCLK/PHYAD1)
LAN_RXD0/MODE0: R3002.1 R3018.2 U3000.11(RXD0/MODE0)
LAN_RXD1/MODE1: R3003.1 R3019.2 U3000.10(RXD1/MODE1)
LAN_RXD2/RMIISEL: R3004.1 R3014.2 U3000.9(RXD2/RMIISEL)
LAN_RXD3/PHYAD2: R3005.1 R3017.2 U3000.8(RXD3/PHYAD2)
LAN_RXER/PHYAD0: R3007.1 R3015.2 U3000.13(RXER/RXD4/PHYAD0)
MCU_nRST: U3000.19(NRST)
NetC3000_1: C3000.1 R3011.2 X3000.3
NetC3001_1: C3001.1 R3012.2 X3000.1
NetC3104_2: C3104.2 R3104.2 U3100.4(2,5V) U3100.5(2,5V)
NetR3001_1: R3001.1 U3000.20(TXCLK)
NetR3008_1: R3008.1 U3000.14(CRS)
NetR3009_1: R3009.1 U3000.26(RXDV)
NetR3105_1: R3105.1 U3100.10(Green-)
NetR3106_1: R3106.1 U3100.11(Yellow-)

### Layout directives
differential pair; differential pair class ETH_TX: ETH_TX_N, ETH_TX_P
differential pair; differential pair class ETH_RX: ETH_RX_N, ETH_RX_P

### Notes on the sheet
- PA2
- PC1
- PB11
- PB12
- PB13
- PC3
- PC2
- PC4
- PC5
- PE2
- PA0
- PA3
- PB0
- PB1
- PB10
- PA1
- PA7
- (in symbol HR911105A) 1 TX+; 2 TX-; 3 RX+; 6 RX-; Green LED; Yellow LED

### Library data of the parts
C3000 C3001 = Cap: Ceramic Capacitor SMD 0402 22pF ±20% 50V
C3002 C3004 C3005 = Cap: as C1201 on sheet 01 - ST-LINK V2.1
C3003 = Cap: Ceramic Capacitor SMD 0603 10uF ±20% 10V
C3006 = Cap: Ceramic Capacitor SMD 0402 470nF ±20% 10V
C3007 = Cap: Ceramic Capacitor SMD 0603 1uF ±20% 50V
C3100-C3103 = Cap: Ceramic Capacitor SMD 0402 33pF ±20% 50V
C3104 = Cap: Ceramic Capacitor SMD 0402 22nF ±20% 50V
L3000 L3100 = Ferrite bead: Ferrite bead SMD 0603 120 Ohm @100MHz
R3000 R3018-R3020 = Res: Resistor SMD 0402 1.5K 1% 0.063W
R3001-R3011 R3104 = Res: Resistor SMD 0402 0R 1% 0.063W
R3012 = Res: Resistor SMD 0402 10R 1% 0.063W
R3013-R3017 R3022 = Res: Resistor SMD 0402 10K 1% 0.063W
R3021 = Res: Resistor SMD 0402 12.1K 1% 0.063W
R3100-R3103 = Res: Resistor SMD 0402 49.9R 1% 0.063W
R3105 R3106 = Res: Resistor SMD 0402 680R 1% 0.063W
R3107 = Res: Resistor SMD 1206 0.1R 1% 0.25W
U3000 = LAN8710A: Microchip MII/RMII 10/100 Ethernet Transceiver / with HP Auto-MDIX and flexPWR® Technology; Manufacturer_Part_Number: LAN8710AI-EZK; Datasheet Link: http://docs-emea.rs-online.com/webdocs/11b5/0900766b811b5c4b.pdf; Height: 1mm; Manufacturer_Name: Microchip; Mouser Part Number: 886-LAN8710AI-EZK; Mouser Price/Stock: https://www.mouser.com/Search/Refine.aspx?Keyword=886-LAN8710AI-EZK; RS Part Number: 7748024P; RS Price/Stock: http://uk.rs-online.com/web/p/products/7748024P
U3100 = HR911105A: HanRun Single port RJ45 Connector with Integrated Magnetics and LED for 10/100-BaseTX NIC Applications; Value: HR911105A
X3000 = XT4: Crystal Oscillator SMD-3225 25MHz 4-pin

## Sheet 04 - AUDIO.SchDoc
size A4
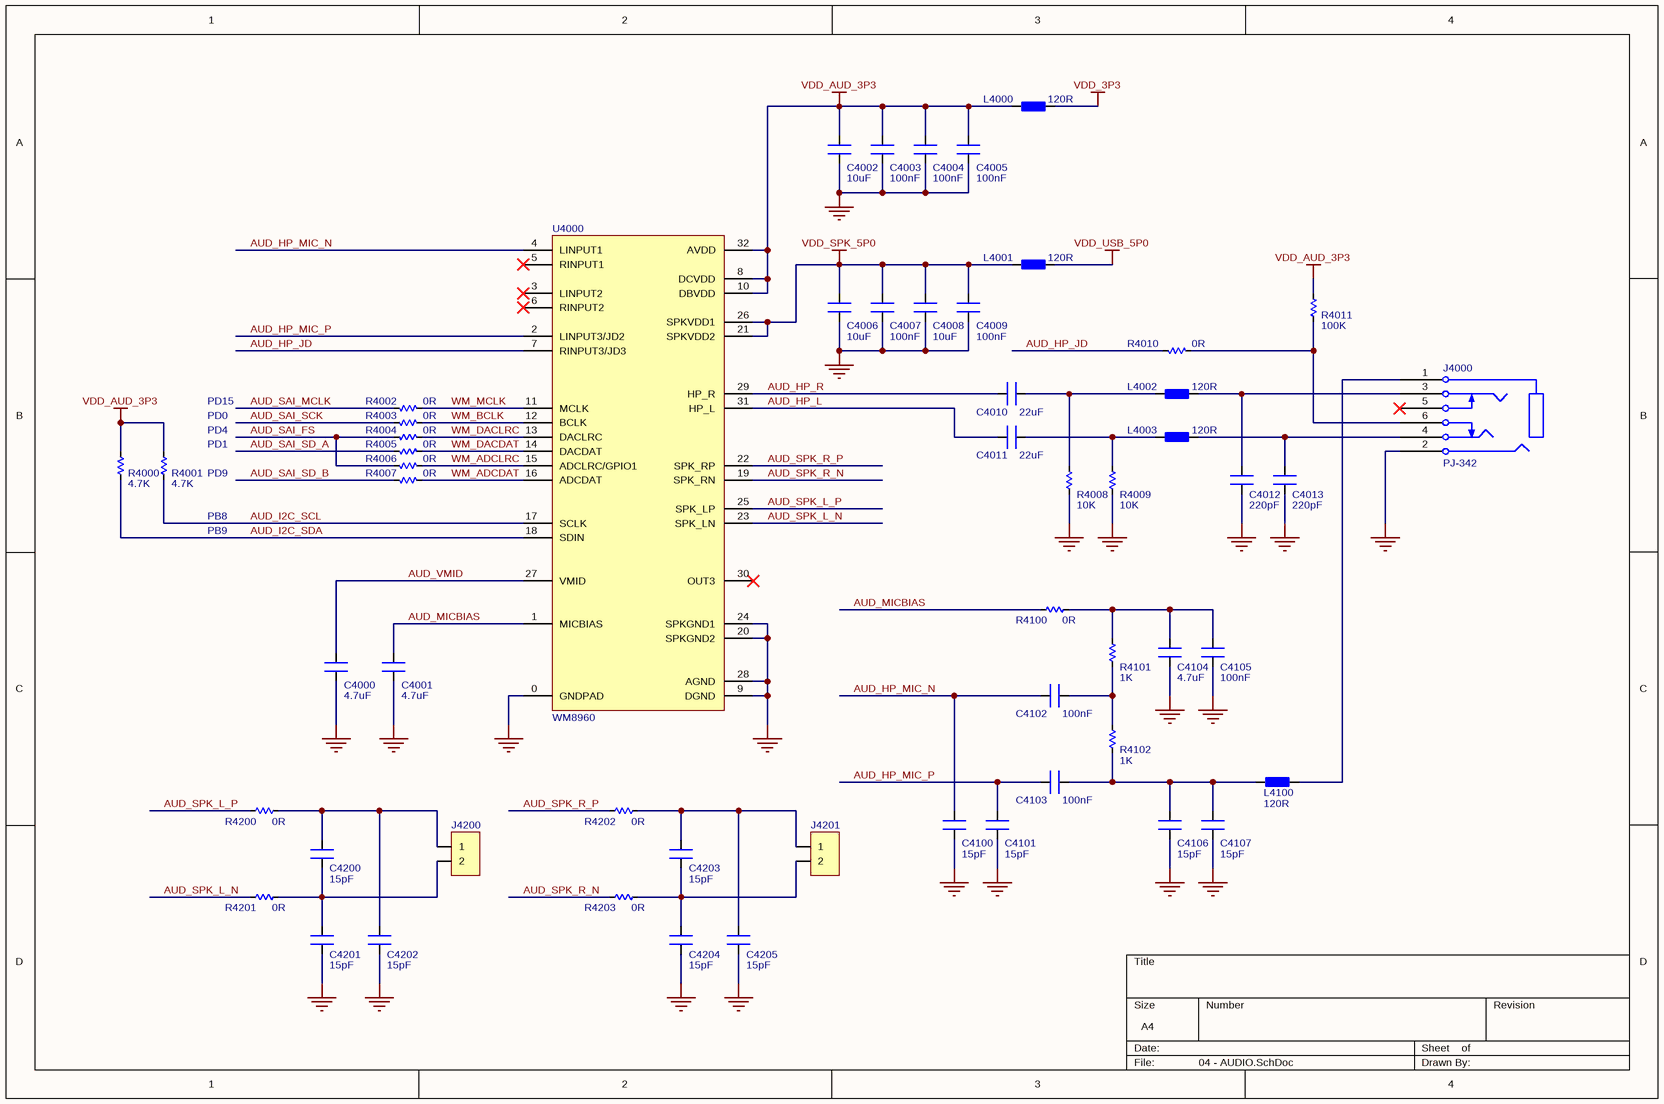
[diagram p3: 04 - AUDIO.SchDoc]

### Parts
C4000  value 4.7uF  [CN-SMD-0402]  (hidden comment: Capacitor)
C4001  value 4.7uF  [CN-SMD-0402]  (hidden comment: Capacitor)
C4002  value 10uF  [CN-SMD-0603]  (hidden comment: Capacitor)
C4003  value 100nF  [CN-SMD-0402]  (hidden comment: Capacitor)
C4004  value 100nF  [CN-SMD-0402]  (hidden comment: Capacitor)
C4005  value 100nF  [CN-SMD-0402]  (hidden comment: Capacitor)
C4006  value 10uF  [CN-SMD-0603]  (hidden comment: Capacitor)
C4007  value 100nF  [CN-SMD-0603]  (hidden comment: Capacitor)
C4008  value 10uF  [CN-SMD-0603]  (hidden comment: Capacitor)
C4009  value 100nF  [CN-SMD-0603]  (hidden comment: Capacitor)
C4010  value 22uF  [CN-SMD-0603]  (hidden comment: Capacitor)
C4011  value 22uF  [CN-SMD-0603]  (hidden comment: Capacitor)
C4012  value 220pF  [CN-SMD-0402]  (hidden comment: Capacitor)
C4013  value 220pF  [CN-SMD-0402]  (hidden comment: Capacitor)
C4100  value 15pF  [CN-SMD-0402]  (hidden comment: Capacitor)
C4101  value 15pF  [CN-SMD-0402]  (hidden comment: Capacitor)
C4102  value 100nF  [CN-SMD-0402]  (hidden comment: Capacitor)
C4103  value 100nF  [CN-SMD-0402]  (hidden comment: Capacitor)
C4104  value 4.7uF  [CN-SMD-0402]  (hidden comment: Capacitor)
C4105  value 100nF  [CN-SMD-0402]  (hidden comment: Capacitor)
C4106  value 15pF  [CN-SMD-0402]  (hidden comment: Capacitor)
C4107  value 15pF  [CN-SMD-0402]  (hidden comment: Capacitor)
C4200  value 15pF  [CN-SMD-0402]  (hidden comment: Capacitor)
C4201  value 15pF  [CN-SMD-0402]  (hidden comment: Capacitor)
C4202  value 15pF  [CN-SMD-0402]  (hidden comment: Capacitor)
C4203  value 15pF  [CN-SMD-0402]  (hidden comment: Capacitor)
C4204  value 15pF  [CN-SMD-0402]  (hidden comment: Capacitor)
C4205  value 15pF  [CN-SMD-0402]  (hidden comment: Capacitor)
J4000  PJ-342  [AUDIO_PJ-342]
J4200  JP2  [JP2-D1T]  (value not drawn)
J4201  JP2  [JP2-D1T]  (value not drawn)
L4000  value 120R  [L-SMD-0402]  (hidden comment: Ferrite bead)
L4001  value 120R  [L-SMD-0603]  (hidden comment: Ferrite bead)
L4002  value 120R  [L-SMD-0402]  (hidden comment: Ferrite bead)
L4003  value 120R  [L-SMD-0402]  (hidden comment: Ferrite bead)
L4100  value 120R  [L-SMD-0402]  (hidden comment: Ferrite bead)
R4000  value 4.7K  [RES-SMD-0402]  (hidden comment: Resistor)
R4001  value 4.7K  [RES-SMD-0402]  (hidden comment: Resistor)
R4002  value 0R  [RES-SMD-0402]  (hidden comment: Resistor)
R4003  value 0R  [RES-SMD-0402]  (hidden comment: Resistor)
R4004  value 0R  [RES-SMD-0402]  (hidden comment: Resistor)
R4005  value 0R  [RES-SMD-0402]  (hidden comment: Resistor)
R4006  value 0R  [RES-SMD-0402]  (hidden comment: Resistor)
R4007  value 0R  [RES-SMD-0402]  (hidden comment: Resistor)
R4008  value 10K  [RES-SMD-0402]  (hidden comment: Resistor)
R4009  value 10K  [RES-SMD-0402]  (hidden comment: Resistor)
R4010  value 0R  [RES-SMD-0402]  (hidden comment: Resistor)
R4011  value 100K  [RES-SMD-0402]  (hidden comment: Resistor)
R4100  value 0R  [RES-SMD-0402]  (hidden comment: Resistor)
R4101  value 1K  [RES-SMD-0402]  (hidden comment: Resistor)
R4102  value 1K  [RES-SMD-0402]  (hidden comment: Resistor)
R4200  value 0R  [RES-SMD-0402]  (hidden comment: Resistor)
R4201  value 0R  [RES-SMD-0402]  (hidden comment: Resistor)
R4202  value 0R  [RES-SMD-0402]  (hidden comment: Resistor)
R4203  value 0R  [RES-SMD-0402]  (hidden comment: Resistor)
U4000  WM8960  [QFN50P500X500X100-33N-D]

### Nets
GND: C4000.1 C4001.1 C4002.1 C4003.1 C4004.1 C4005.1 C4006.1 C4007.1 C4008.1 C4009.1 C4012.1 C4013.1 C4100.1 C4101.1 C4104.1 C4105.1 C4106.1 C4107.1 C4201.1 C4202.1 C4204.1 C4205.1 J4000.2(GND) R4008.2 R4009.2 U4000.0(GNDPAD) U4000.9(DGND) U4000.20(SPKGND2) U4000.24(SPKGND1) U4000.28(AGND)
VDD_3P3: L4000.1
VDD_AUD_3P3: C4002.2 C4003.2 C4004.2 C4005.2 L4000.2 R4000.1 R4001.1 R4011.1 U4000.8(DCVDD) U4000.10(DBVDD) U4000.32(AVDD)
VDD_SPK_5P0: C4006.2 C4007.2 C4008.2 C4009.2 L4001.2 U4000.21(SPKVDD2) U4000.26(SPKVDD1)
VDD_USB_5P0: L4001.1
AUD_HP_JD: R4010.2 U4000.7(RINPUT3/JD3)
AUD_HP_L: C4011.2 U4000.31(HP_L)
AUD_HP_MIC_N: C4100.2 C4102.2 U4000.4(LINPUT1)
AUD_HP_MIC_P: C4101.2 C4103.2 U4000.2(LINPUT3/JD2)
AUD_HP_R: C4010.2 U4000.29(HP_R)
AUD_I2C_SCL: R4001.2 U4000.17(SCLK)
AUD_I2C_SDA: R4000.2 U4000.18(SDIN)
AUD_MICBIAS: C4001.2 R4100.1 U4000.1(MICBIAS)
AUD_SAI_FS: R4004.2 R4006.2
AUD_SAI_MCLK: R4002.2
AUD_SAI_SCK: R4003.2
AUD_SAI_SD_A: R4005.2
AUD_SAI_SD_B: R4007.2
AUD_SPK_L_N: R4201.1 U4000.23(SPK_LN)
AUD_SPK_L_P: R4200.1 U4000.25(SPK_LP)
AUD_SPK_R_N: R4203.1 U4000.19(SPK_RN)
AUD_SPK_R_P: R4202.1 U4000.22(SPK_RP)
AUD_VMID: C4000.2 U4000.27(VMID)
WM_ADCDAT: R4007.1 U4000.16(ADCDAT)
WM_ADCLRC: R4006.1 U4000.15(ADCLRC/GPIO1)
WM_BCLK: R4003.1 U4000.12(BCLK)
WM_DACDAT: R4005.1 U4000.14(DACDAT)
WM_DACLRC: R4004.1 U4000.13(DACLRC)
WM_MCLK: R4002.1 U4000.11(MCLK)
NetC4010_1: C4010.1 L4002.2 R4008.1
NetC4011_1: C4011.1 L4003.2 R4009.1
NetC4012_2: C4012.2 J4000.3(RIGHT) L4002.1
NetC4013_2: C4013.2 J4000.4(LEFT) L4003.1
NetC4102_1: C4102.1 R4101.2 R4102.1
NetC4103_1: C4103.1 C4106.2 C4107.2 L4100.2 R4102.2
NetC4104_2: C4104.2 C4105.2 R4100.2 R4101.1
NetC4200_1: C4200.1 C4201.2 J4200.2 R4201.2
NetC4200_2: C4200.2 C4202.2 J4200.1 R4200.2
NetC4203_1: C4203.1 C4204.2 J4201.2 R4203.2
NetC4203_2: C4203.2 C4205.2 J4201.1 R4202.2
NetJ4000_1: J4000.1(MIC) L4100.1
NetJ4000_6: J4000.6 R4010.1 R4011.2

Not connected (* = marked no-connect by the designer): J4000 5*; U4000 3(LINPUT2)* 5(RINPUT1)* 6(RINPUT2)* 30(OUT3)*

### Notes on the sheet
- PD15
- (near R4001) PD1
- (near R4001) PD4
- (near R4001) PD0
- (near R4001) PD9
- (near R4001) PB8
- PB9

### Library data of the parts
C4000 C4001 C4104 = Cap: Ceramic Capacitor SMD 0402 4.7uF ±20% 10V
C4002 C4006 C4008 = Cap: Ceramic Capacitor SMD 0603 10uF ±20% 10V
C4003-C4005 C4102 C4103 C4105 = Cap: as C1201 on sheet 01 - ST-LINK V2.1
C4007 C4009 = Cap: as C1100 on sheet 01 - ST-LINK V2.1
C4010 C4011 = Cap: Ceramic Capacitor SMD 0603 22uF ±20% 6.3V
C4012 C4013 = Cap: Ceramic Capacitor SMD 0402 220pF ±20% 50V
C4100 C4101 C4106 C4107 C4200-C4205 = Cap: Ceramic Capacitor SMD 0402 15pF ±20% 50V
J4000 = PJ-342: Audio connector PJ-342 3.5mm 4-pole; Connector type: AUDIO BLACK HEADER; Category: Connector; Status: Production
J4200 J4201 = JP2: Single 2-pin jumper
L4000 L4002 L4003 L4100 = Ferrite bead: Ferrite bead SMD 0402 120 Ohm @100MHz
L4001 = Ferrite bead: Ferrite bead SMD 0603 120 Ohm @100MHz
R4000 R4001 = Res: Resistor SMD 0402 4.7K 1% 0.063W
R4002-R4007 R4010 R4100 R4200-R4203 = Res: Resistor SMD 0402 0R 1% 0.063W
R4008 R4009 = Res: Resistor SMD 0402 10K 1% 0.063W
R4011 = Res: Resistor SMD 0402 100K 1% 0.063W
R4101 R4102 = Res: Resistor SMD 0402 1K 1% 0.063W
U4000 = WM8960: Cirrus Logic Stereo CODEC with 1W Stereo Class-D Speaker Drivers and Headphone Drivers for Portable Audio Applications

## Sheet 05 - QSPI & SD-CARD.SchDoc
size A4
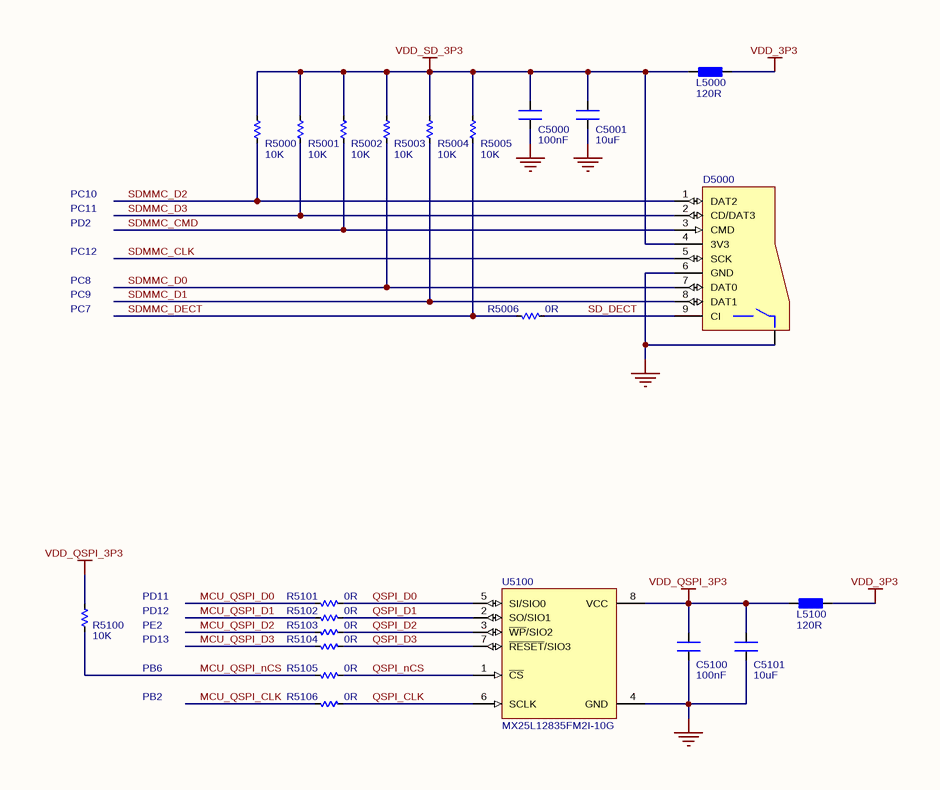
[diagram p4: 05 - QSPI & SD-CARD.SchDoc]

### Parts
C5000  value 100nF  [CN-SMD-0402]  (hidden comment: Capacitor)
C5001  value 10uF  [CN-SMD-0603]  (hidden comment: Capacitor)
C5100  value 100nF  [CN-SMD-0402]  (hidden comment: Capacitor)
C5101  value 10uF  [CN-SMD-0603]  (hidden comment: Capacitor)
D5000  microSD card socket  [MICROSD1]  (value not drawn)
L5000  value 120R  [L-SMD-0402]  (hidden comment: Ferrite bead)
L5100  value 120R  [L-SMD-0402]  (hidden comment: Ferrite bead)
R5000  value 10K  [RES-SMD-0402]  (hidden comment: Resistor)
R5001  value 10K  [RES-SMD-0402]  (hidden comment: Resistor)
R5002  value 10K  [RES-SMD-0402]  (hidden comment: Resistor)
R5003  value 10K  [RES-SMD-0402]  (hidden comment: Resistor)
R5004  value 10K  [RES-SMD-0402]  (hidden comment: Resistor)
R5005  value 10K  [RES-SMD-0402]  (hidden comment: Resistor)
R5006  value 0R  [RES-SMD-0402]  (hidden comment: Resistor)
R5100  value 10K  [RES-SMD-0402]  (hidden comment: Resistor)
R5101  value 0R  [RES-SMD-0402]  (hidden comment: Resistor)
R5102  value 0R  [RES-SMD-0402]  (hidden comment: Resistor)
R5103  value 0R  [RES-SMD-0402]  (hidden comment: Resistor)
R5104  value 0R  [RES-SMD-0402]  (hidden comment: Resistor)
R5105  value 0R  [RES-SMD-0402]  (hidden comment: Resistor)
R5106  value 0R  [RES-SMD-0402]  (hidden comment: Resistor)
U5100  MX25L12835FM2I-10G  [SOIC127P798X216-8N]

### Nets
GND: C5000.1 C5001.1 C5100.1 C5101.1 D5000.0(NC) D5000.6(GND) U5100.4(GND)
VDD_3P3: L5000.1 L5100.1
VDD_QSPI_3P3: C5100.2 C5101.2 L5100.2 R5100.1 U5100.8(VCC)
VDD_SD_3P3: C5000.2 C5001.2 D5000.4(3V3) L5000.2 R5000.1 R5001.1 R5002.1 R5003.1 R5004.1 R5005.1
MCU_QSPI_CLK: R5106.2
MCU_QSPI_D0: R5101.2
MCU_QSPI_D1: R5102.2
MCU_QSPI_D2: R5103.2  [project net ETH_MII_TXD3]
MCU_QSPI_D3: R5104.2
MCU_QSPI_nCS: R5100.2 R5105.2
QSPI_CLK: R5106.1 U5100.6(SCLK)
QSPI_D0: R5101.1 U5100.5(SI/SIO0)
QSPI_D1: R5102.1 U5100.2(SO/SIO1)
QSPI_D2: R5103.1 U5100.3(~{WP}/SIO2)
QSPI_D3: R5104.1 U5100.7(~{RESET}/SIO3)
QSPI_nCS: R5105.1 U5100.1(~{CS})
SD_DECT: D5000.9(CI) R5006.1
SDMMC_CLK: D5000.5(SCK)
SDMMC_CMD: D5000.3(CMD) R5002.2
SDMMC_D0: D5000.7(DAT0) R5003.2
SDMMC_D1: D5000.8(DAT1) R5004.2
SDMMC_D2: D5000.1(DAT2) R5000.2
SDMMC_D3: D5000.2(CD/DAT3) R5001.2
SDMMC_DECT: R5005.2 R5006.2

### Notes on the sheet
- PC10
- PC11
- PD2
- PC8
- PC9
- PC12
- PC7
- PD11
- PD12
- PD13
- PE2
- PB2
- PB6

### Library data of the parts
C5000 C5100 = Cap: as C1201 on sheet 01 - ST-LINK V2.1
C5001 C5101 = Cap: Ceramic Capacitor SMD 0603 10uF ±20% 10V
D5000 = microSD card SDIO
L5000 L5100 = Ferrite bead: Ferrite bead SMD 0402 120 Ohm @100MHz
R5000-R5005 R5100 = Res: Resistor SMD 0402 10K 1% 0.063W
R5006 R5101-R5106 = Res: Resistor SMD 0402 0R 1% 0.063W
U5100 = MX25L12835FM2I-10G: Macronix 3V, 128M-BIT [x1/x2/x4] CMOS MXSMIO® (Serial Multi I/O) Flash Memory

## Sheet 06 - USB.SchDoc
size A4
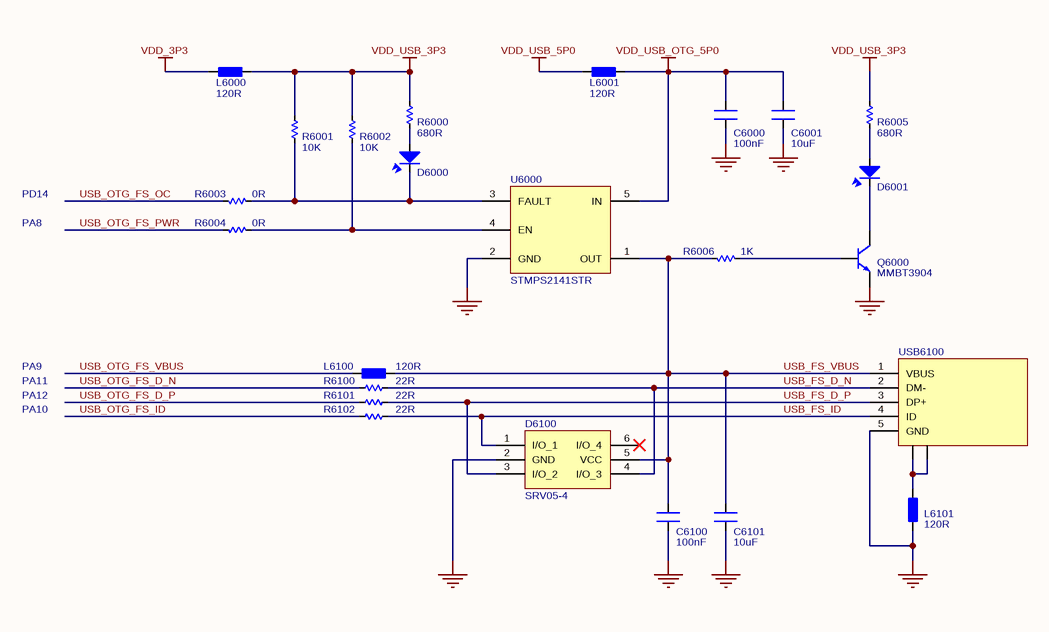
[diagram p5: 06 - USB.SchDoc]

### Parts
C6000  value 100nF  [CN-SMD-0402]  (hidden comment: Capacitor)
C6001  value 10uF  [CN-SMD-0603]  (hidden comment: Capacitor)
C6100  value 100nF  [CN-SMD-0603]  (hidden comment: Capacitor)
C6101  value 10uF  [CN-SMD-0603]  (hidden comment: Capacitor)
D6000  LED  [LED-SMD-0805-RED]  (value not drawn)
D6001  LED  [LED-SMD-0805-GREEN]  (value not drawn)
D6100  SRV05-4  [SOT95P280X145-6N]
L6000  value 120R  [L-SMD-0402]  (hidden comment: Ferrite bead)
L6001  value 120R  [L-SMD-0603]  (hidden comment: Ferrite bead)
L6100  value 120R  [L-SMD-0603]  (hidden comment: Ferrite bead)
L6101  value 120R  [L-SMD-0603]  (hidden comment: Ferrite bead)
Q6000  MMBT3904  [SOT-23-3]
R6000  value 680R  [RES-SMD-0402]  (hidden comment: Resistor)
R6001  value 10K  [RES-SMD-0402]  (hidden comment: Resistor)
R6002  value 10K  [RES-SMD-0402]  (hidden comment: Resistor)
R6003  value 0R  [RES-SMD-0402]  (hidden comment: Resistor)
R6004  value 0R  [RES-SMD-0402]  (hidden comment: Resistor)
R6005  value 680R  [RES-SMD-0402]  (hidden comment: Resistor)
R6006  value 1K  [RES-SMD-0402]  (hidden comment: Resistor)
R6100  value 22R  [RES-SMD-0402]  (hidden comment: Resistor)
R6101  value 22R  [RES-SMD-0402]  (hidden comment: Resistor)
R6102  value 22R  [RES-SMD-0402]  (hidden comment: Resistor)
U6000  STMPS2141STR  [SOT95P280X145-5N]
USB6100  USB  [USB_micro-B_F_SMD-2]  (value not drawn)

### Nets
GND: C6000.1 C6001.1 C6100.1 C6101.1 D6100.2(GND) L6101.1 Q6000.2(Emitter) U6000.2(GND) USB6100.5(GND)
VDD_3P3: L6000.2
VDD_USB_3P3: L6000.1 R6000.1 R6001.1 R6002.1 R6005.1
VDD_USB_5P0: L6001.2
VDD_USB_OTG_5P0: C6000.2 C6001.2 L6001.1 U6000.5(IN)
USB_FS_D_N: D6100.4(I/O_3) R6100.1 USB6100.2(DM-)
USB_FS_D_P: D6100.3(I/O_2) R6101.1 USB6100.3(DP+)
USB_FS_ID: D6100.1(I/O_1) R6102.1 USB6100.4(ID)
USB_FS_VBUS: C6100.2 C6101.2 D6100.5(VCC) L6100.1 R6006.2 U6000.1(OUT) USB6100.1(VBUS)
USB_OTG_FS_D_N: R6100.2
USB_OTG_FS_D_P: R6101.2
USB_OTG_FS_ID: R6102.2
USB_OTG_FS_OC: R6003.2
USB_OTG_FS_PWR: R6004.2
USB_OTG_FS_VBUS: L6100.2
NetD6000_1: D6000.1 R6000.2
NetD6000_2: D6000.2 R6001.2 R6003.1 U6000.3(FAULT)
NetD6001_1: D6001.1 R6005.2
NetD6001_2: D6001.2 Q6000.3(Collector)
NetL6101_2: L6101.2 USB6100.0
NetQ6000_1: Q6000.1(Base) R6006.1
NetR6002_2: R6002.2 R6004.1 U6000.4(EN)

Not connected (* = marked no-connect by the designer): D6100 6(I/O_4)*

### Notes on the sheet
- PA8
- PD14
- PA9
- PA10
- PA11
- PA12

### Library data of the parts
C6000 = Cap: as C1201 on sheet 01 - ST-LINK V2.1
C6001 C6101 = Cap: Ceramic Capacitor SMD 0603 10uF ±20% 10V
C6100 = Cap: as C1100 on sheet 01 - ST-LINK V2.1
D6000 = LED: LED red color SMD-0805
D6001 = LED: LED green color SMD-0805
D6100 = SRV05-4: Low capacitance TVS Diode array
L6000 = Ferrite bead: Ferrite bead SMD 0402 120 Ohm @100MHz
L6001 L6100 L6101 = Ferrite bead: Ferrite bead SMD 0603 120 Ohm @100MHz
Q6000 = MMBT3904: 40V NPN small signal transistor SOT-23-5
R6000 R6005 = Res: Resistor SMD 0402 680R 1% 0.063W
R6001 R6002 = Res: Resistor SMD 0402 10K 1% 0.063W
R6003 R6004 = Res: Resistor SMD 0402 0R 1% 0.063W
R6006 = Res: Resistor SMD 0402 1K 1% 0.063W
R6100-R6102 = Res: Resistor SMD 0402 22R 1% 0.063W
U6000 = STMPS2141STR: Enhanced single channel power switches; Manufacturer_Name: STMicroelectronics; Datasheet Link: http://uk.rs-online.com/web/p/products/8805406; Height: 1.45mm; Manufacturer_Part_Number: STMPS2141STR; Mouser Part Number: 511-STMPS2141STR; Mouser Price/Stock: https://www.mouser.com/Search/Refine.aspx?Keyword=511-STMPS2141STR; RS Part Number: 8805406P; RS Price/Stock: http://uk.rs-online.com/web/p/products/8805406P
USB6100 = USB-5: USB female SMD micro-B type

## Nets that join several sheets
GND: 01 - ST-LINK V2.1 (35 pins), 02 - MCU (35 pins), 03 - ETHERNET (28 pins), 04 - AUDIO (30 pins), 05 - QSPI & SD-CARD (7 pins), 06 - USB (9 pins)
VDD_3P3: 01 - ST-LINK V2.1 (5 pins), 02 - MCU (J2102.4 L2001.2), 03 - ETHERNET (L3000.2 L3100.1), 04 - AUDIO (L4000.1), 05 - QSPI & SD-CARD (L5000.1 L5100.1), 06 - USB (L6000.2)
VDD_USB_5P0: 01 - ST-LINK V2.1 (6 pins), 02 - MCU (J2102.5 J2102.8), 04 - AUDIO (L4001.1), 06 - USB (L6001.2)
AUD_I2C_SCL: 02 - MCU (J2100.1 U2000.95), 04 - AUDIO (R4001.2 U4000.17)
AUD_I2C_SDA: 02 - MCU (J2100.2 U2000.96), 04 - AUDIO (R4000.2 U4000.18)
AUD_SAI_FS: 02 - MCU (U2000.85), 04 - AUDIO (R4004.2 R4006.2)
AUD_SAI_MCLK: 02 - MCU (U2000.62), 04 - AUDIO (R4002.2)
AUD_SAI_SCK: 02 - MCU (U2000.81), 04 - AUDIO (R4003.2)
AUD_SAI_SD_A: 02 - MCU (U2000.82), 04 - AUDIO (R4005.2)
AUD_SAI_SD_B: 02 - MCU (U2000.56), 04 - AUDIO (R4007.2)
ETH_MDIO_CLK: 02 - MCU (U2000.16), 03 - ETHERNET (U3000.17)
ETH_MDIO_DATA: 02 - MCU (U2000.24), 03 - ETHERNET (R3000.1 U3000.16)
ETH_MII_COL: 02 - MCU (U2000.25), 03 - ETHERNET (R3006.2)
ETH_MII_CRS: 02 - MCU (U2000.22), 03 - ETHERNET (R3008.2)
ETH_MII_RXCLK: 02 - MCU (U2000.23), 03 - ETHERNET (R3010.2)
ETH_MII_RXD0: 02 - MCU (U2000.32), 03 - ETHERNET (R3002.2)
ETH_MII_RXD1: 02 - MCU (U2000.33), 03 - ETHERNET (R3003.2)
ETH_MII_RXD2: 02 - MCU (U2000.34), 03 - ETHERNET (R3004.2)
ETH_MII_RXD3: 02 - MCU (U2000.35), 03 - ETHERNET (R3005.2)
ETH_MII_RXDV: 02 - MCU (U2000.31), 03 - ETHERNET (R3009.2)
ETH_MII_RXER: 02 - MCU (U2000.46), 03 - ETHERNET (R3007.2)
ETH_MII_TXCLK: 02 - MCU (U2000.18), 03 - ETHERNET (R3001.2)
ETH_MII_TXD0: 02 - MCU (U2000.51), 03 - ETHERNET (U3000.22)
ETH_MII_TXD1: 02 - MCU (U2000.52), 03 - ETHERNET (U3000.23)
ETH_MII_TXD2: 02 - MCU (U2000.17), 03 - ETHERNET (U3000.24)
ETH_MII_TXD3: 02 - MCU (U2000.1), 03 - ETHERNET (U3000.25), 05 - QSPI & SD-CARD (R5103.2)
ETH_MII_TXEN: 02 - MCU (U2000.47), 03 - ETHERNET (U3000.21)
MCU_nRST: 02 - MCU (5 pins), 03 - ETHERNET (U3000.19)
MCU_QSPI_CLK: 02 - MCU (U2000.36), 05 - QSPI & SD-CARD (R5106.2)
MCU_QSPI_D0: 02 - MCU (U2000.58), 05 - QSPI & SD-CARD (R5101.2)
MCU_QSPI_D1: 02 - MCU (U2000.59), 05 - QSPI & SD-CARD (R5102.2)
MCU_QSPI_D3: 02 - MCU (U2000.60), 05 - QSPI & SD-CARD (R5104.2)
MCU_QSPI_nCS: 02 - MCU (U2000.92), 05 - QSPI & SD-CARD (R5100.2 R5105.2)
MCU_STLK_RX: 01 - ST-LINK V2.1 (R1208.1), 02 - MCU (U2000.37)
MCU_STLK_TX: 01 - ST-LINK V2.1 (R1209.1), 02 - MCU (U2000.38)
SDMMC_CLK: 02 - MCU (U2000.80), 05 - QSPI & SD-CARD (D5000.5)
SDMMC_CMD: 02 - MCU (U2000.83), 05 - QSPI & SD-CARD (D5000.3 R5002.2)
SDMMC_D0: 02 - MCU (U2000.65), 05 - QSPI & SD-CARD (D5000.7 R5003.2)
SDMMC_D1: 02 - MCU (U2000.66), 05 - QSPI & SD-CARD (D5000.8 R5004.2)
SDMMC_D2: 02 - MCU (U2000.78), 05 - QSPI & SD-CARD (D5000.1 R5000.2)
SDMMC_D3: 02 - MCU (U2000.79), 05 - QSPI & SD-CARD (D5000.2 R5001.2)
SDMMC_DECT: 02 - MCU (U2000.64), 05 - QSPI & SD-CARD (R5005.2 R5006.2)
T_JTCK: 01 - ST-LINK V2.1 (U1200.15 U1200.26), 02 - MCU (R2304.1)
T_JTMS: 01 - ST-LINK V2.1 (R1202.1 U1200.27), 02 - MCU (R2303.1)
T_NRST: 01 - ST-LINK V2.1 (U1200.18), 02 - MCU (R2306.1)
T_SWO: 01 - ST-LINK V2.1 (U1200.31), 02 - MCU (R2305.1)
USB_OTG_FS_D_N: 02 - MCU (U2000.70), 06 - USB (R6100.2)
USB_OTG_FS_D_P: 02 - MCU (U2000.71), 06 - USB (R6101.2)
USB_OTG_FS_ID: 02 - MCU (U2000.69), 06 - USB (R6102.2)
USB_OTG_FS_OC: 02 - MCU (U2000.61), 06 - USB (R6003.2)
USB_OTG_FS_PWR: 02 - MCU (U2000.67), 06 - USB (R6004.2)
USB_OTG_FS_VBUS: 02 - MCU (U2000.68), 06 - USB (L6100.2)